# EAGLE design Adafruit USB Type C Downstream Breakout rev A (EAGLE 9.2.0)
COMPANY: ADAFRUIT INDUSTRIES; DRAWN: KTOWN; REV: A; YEAR: 2019
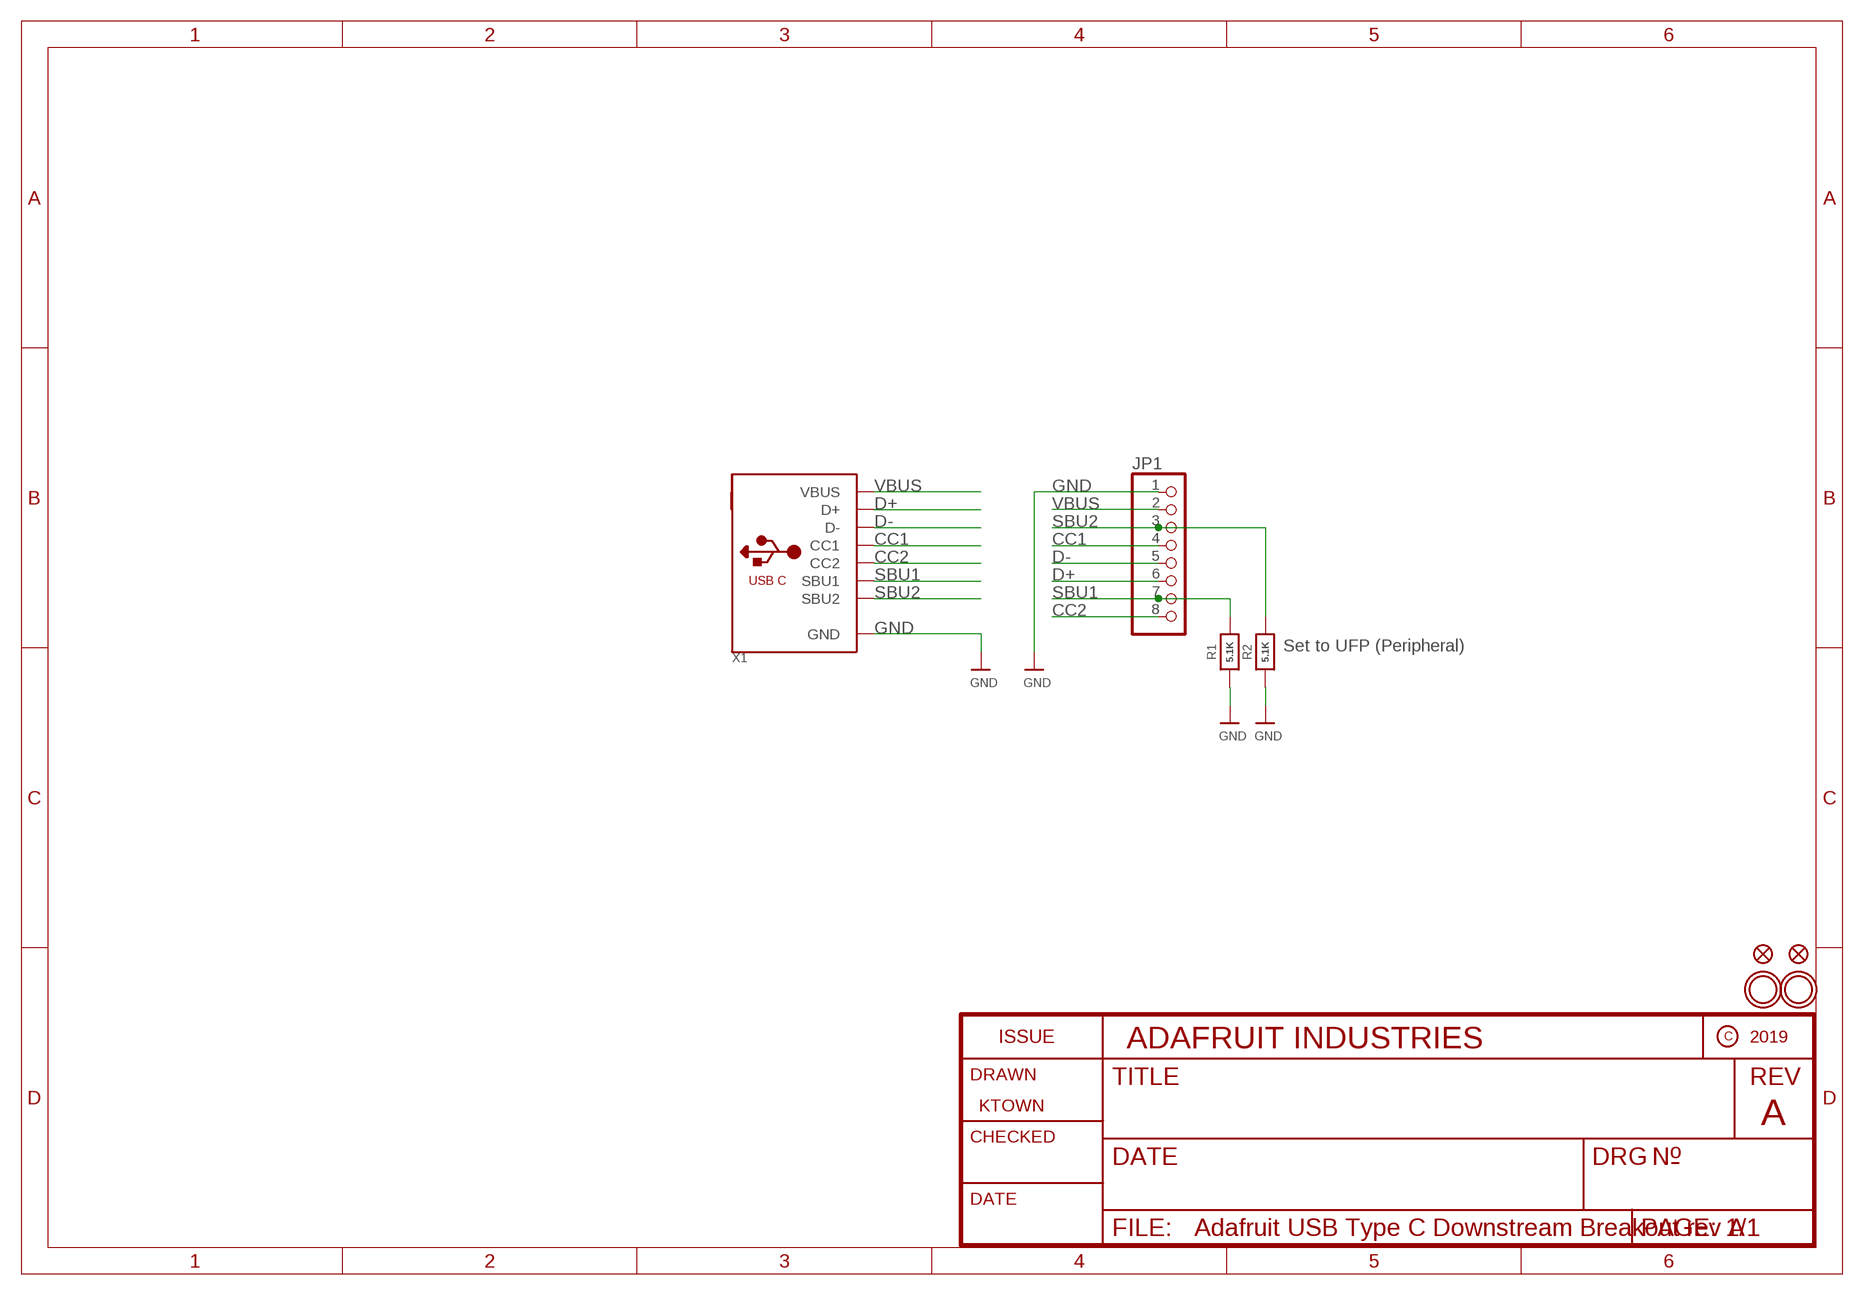
[diagram p0: schematic, sheet 1]

## Parts
FID1  FIDUCIAL_1MM  [FIDUCIAL_1MM]
FID2  FIDUCIAL_1MM  [FIDUCIAL_1MM]
JP1  HEADER-1X876MIL  [1X08_ROUND_76]
R1  5.1K  RESISTOR_0603_NOOUT  [0603-NO]
R2  5.1K  RESISTOR_0603_NOOUT  [0603-NO]
U$1  MOUNTINGHOLE2.5  [MOUNTINGHOLE_2.5_PLATED]
U$2  MOUNTINGHOLE2.5  [MOUNTINGHOLE_2.5_PLATED]
X1  USB_C  [USB_C_CUSB31-CFM2AX-01-X]

## Nets
CC1: JP1.4 X1.A5(CC1)
CC2: JP1.8 X1.B5(CC2)
D+: JP1.6 X1.A6(D+) X1.B6(D+)
D-: JP1.5 X1.A7(D-) X1.B7(D-)
GND: JP1.1 R1.1 R2.1 X1.A1B12(GND) X1.B1A12(GND)
SBU1: JP1.7 R1.2 X1.A8(SBU1)
SBU2: JP1.3 R2.2 X1.B8(SBU2)
VBUS: JP1.2 X1.A4B9(VBUS) X1.B4A9(VBUS)

## Notes on the sheet
- Set to UFP (Peripheral)

## Library data of the parts
FID1 FID2 = microbuilder:FIDUCIAL: Fiducial Alignment Points Various fiducial points for machine vision alignment.; BOM: EXCLUDE
JP1 = microbuilder:HEADER-1X8: PIN HEADER
R1 R2 = microbuilder:RESISTOR: Resistors For new designs, use the packages preceded by an '_' character since they are more reliable: The following footprints should be used on most boards: _0402 - Standard footprint for regular board layouts _0603 - Standard footprint for regular board layouts _0805 - Standard footprint for regular board layouts _1206 - Standard footprint for regular board layouts For extremely tight-pitch boards where space is at a premium, the following 'micro-pitch' footprints can be used (smaller pads, no silkscreen outline, etc.): _0402MP - Micro-pitch footprint for very dense/compact boards _0603MP - Micro-pitch footprint for very dense/compact boards _0805MP - Micro-pitch footprint for very dense/compact boards _1206MP - Micro-pitch footprint for very dense/compact boards
U$1 U$2 = microbuilder:MOUNTINGHOLE: Mounting Hole For #2 screws (0.086"/2.18mm width, 0.094"/2.4mm hole) use 2.5mm; BOM: EXCLUDE
X1 = microbuilder:USB_C: USB Type-C USB 2.0 Connector

## Board
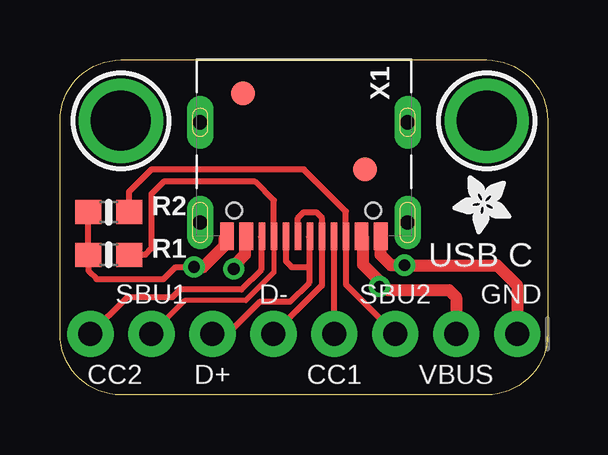
[diagram p1: board, top side]
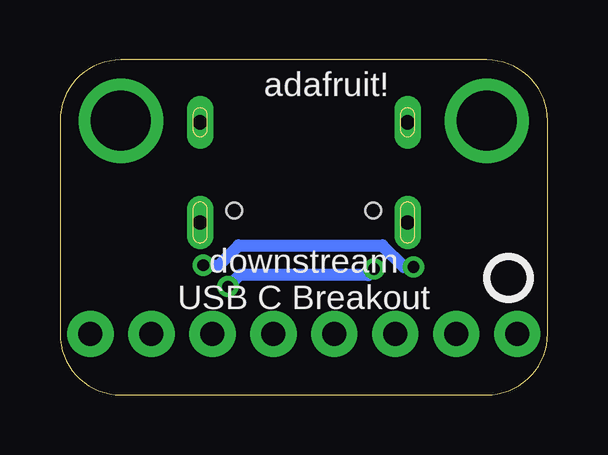
[diagram p2: board, bottom side, seen from below]

Size 20.32 x 13.97 mm. Coordinates in mm from the lower left corner, seen from the top.
Outline: 20.32,11.43 20.32,2.54 arc-90 17.78,0 2.54,0 arc-90 0,2.54 0,11.43 arc-90 2.54,13.97 17.78,13.97 arc-90 20.32,11.43
Copper layers (1*16): Top 0.035mm / dielectric 1.5mm / Bottom 0.035mm
Design rules "adafruit": minimum track width 8mil, minimum drill 15.5mil, track to track 8mil, track to pad 8mil, pad to pad 8mil, via to via 8mil, smd to smd 8mil, copper to edge 10mil, drill to drill 8mil, minimum pad ring 10mil, minimum via ring 8mil, stop-mask expansion 2mil, vias tented up to drill 20mil, thermal gap 10mil

### Footprints (pad centres in the part's own frame; a part is rotated, then mirrored left to right if it is on the bottom)
FIDUCIAL_1MM = smd 1 x 1: 1 0,0
1X08_ROUND_76 = drill 1 pad 1.93: 1 -8.89,0; 2 -6.35,0; 3 -3.81,0; 4 -1.27,0; 5 1.27,0; 6 3.81,0; 7 6.35,0; 8 8.89,0
0603-NO = smd 1.075 x 1: 1 -0.85,0; 2 0.85,0
MOUNTINGHOLE_2.5_PLATED = drill 2.5 pad 3.2: P$1 0,0
USB_C_CUSB31-CFM2AX-01-X = smd 0.575 x 1.15: A1B12 -3.2,7.355; A4B9 -2.4,7.355; B1A12 3.2,7.355; B4A9 2.4,7.355 | smd 0.275 x 1.15: A5 -1.25,7.355; A6 -0.25,7.355; A7 0.25,7.355; A8 1.25,7.355; B5 1.75,7.355; B6 0.75,7.355; B7 -0.75,7.355; B8 -1.75,7.355 | drill 0.6 pad 1 long: M1 -4.32,6.78; M2 4.32,6.78; M3 -4.32,2.6; M4 4.32,2.6 | hole 0.65: 2.89,6.28; -2.89,6.28

### Placement (x,y rotation side)
FID1  12.7,9.4 180 top
FID2  7.62,12.57 180 top
JP1  10.16,2.54 180 top
R1  2.03,5.84 0 top
R2  2.03,7.62 0 top
U$1  17.78,11.43 180 top
U$2  2.54,11.43 180 top
U$3  [ADAFRUIT_2.5MM]  18.8,9.14 180 top
U$8  [PCBFEAT-REV-040]  1.63,4.88 180 bottom
X1  10.16,13.97 180 top

### Tracks (layer width: path | path; a pad name or v marks a point on that pad's centre or on a via)
CC1
  Top 0.254: X1.A5 11.41,2.56 JP1.4
CC2
  Top 0.254: X1.B5 8.38,6.58 8.38,5.21 7.56,4.39 5.02,4.39 4.69,4.06 2.79,4.06 JP1.8
D+
  Top 0.254: X1.A6 10.38,6.58 10.38,5.33 | 10.38,5.33 10.38,4.67 9.58,3.88 8.32,3.88 6.99,2.54 JP1.6 | X1.B6 9.41,5.58 9.65,5.33 10.38,5.33
D-
  Top 0.254: JP1.5 10.91,4.56 X1.B7 10.91,7.35 10.92,7.37 10.67,7.62 10.16,7.62 9.91,7.37 X1.A7
GND  (via drill 0.48)
  Top 0.254: R2.1 R1.1 1.18,5.17 1.52,4.83 4.32,4.83 4.83,5.33 v5.59,5.33
  Top 0.508: JP1.1 19.05,4.57 18.22,5.4 v14.35,5.4 13.8,5.4 13.36,5.84 X1.A1B12 | X1.B1A12 6.85,6.51 6.85,6.22 5.97,5.33 v5.59,5.33 | X1.A1B12
  Bottom 0.508: v5.59,5.33 5.98,5.33 6.88,6.24 12.88,6.24 13.71,5.4 v14.35,5.4
SBU1
  Top 0.203: X1.A8 8.91,5.1 7.75,3.94 5.21,3.94 JP1.7
  Top 0.254: X1.A8 8.91,8.11 8.13,8.89 4.32,8.89 3.81,8.38 3.81,6.1 3.56,5.84 R1.2
SBU2
  Top 0.254: JP1.3 11.91,4.6 X1.B8 11.91,7.65 10.16,9.4 3.81,9.4 2.88,8.47 R2.2
VBUS  (via drill 0.48)
  Top 0.508: X1.A4B9 12.62,6.56 12.62,5.43 13.42,4.62 | 13.42,4.62 13.68,4.37 16.2,4.37 16.51,4.06 JP1.2 | X1.B4A9 7.71,6.56 7.71,5.85 7.24,5.38 v7.24,5.25 | v13.32,4.52 13.42,4.62
  Bottom 0.508: v7.24,5.25 7.49,5 12.84,5 v13.32,4.52

### Text on the board
tPlace: USB C | SBU1 | D- | SBU2 | GND | CC2 | D+ | CC1 | VBUS
bPlace: adafruit! | downstream / USB C Breakout